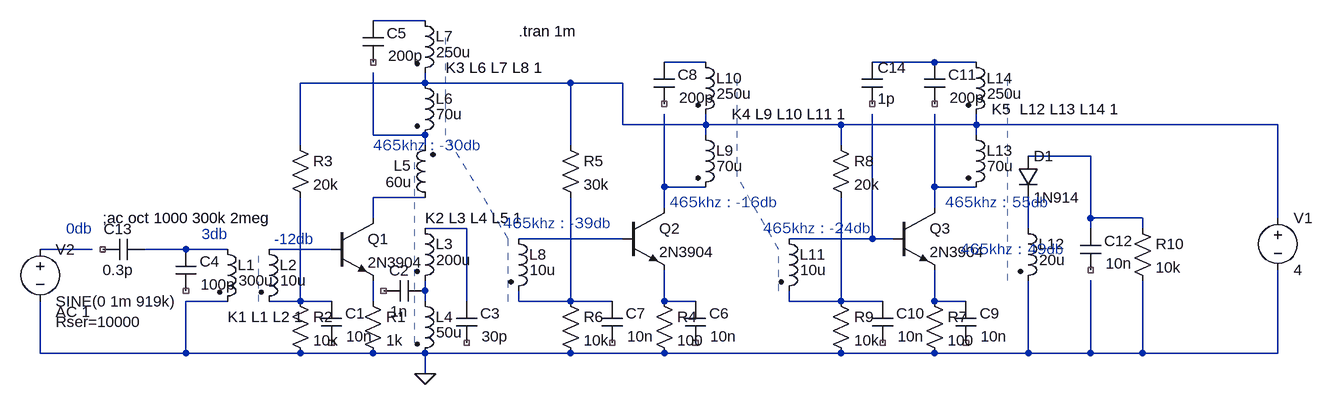
[diagram p0: schematic Draft3.asc]
Draft3.asc, the LTspice schematic file:
Version 4
SHEET 1 1692 680
WIRE 336 -288 256 -288
WIRE 768 -224 704 -224
WIRE 1120 -224 1024 -224
WIRE 1184 -224 1120 -224
WIRE 336 -192 336 -208
WIRE 336 -192 144 -192
WIRE 560 -192 336 -192
WIRE 640 -192 560 -192
WIRE 640 -128 640 -192
WIRE 768 -128 768 -144
WIRE 768 -128 640 -128
WIRE 976 -128 768 -128
WIRE 1184 -128 1184 -144
WIRE 1184 -128 976 -128
WIRE 1648 -128 1184 -128
WIRE 256 -112 256 -208
WIRE 336 -112 256 -112
WIRE 768 -112 768 -128
WIRE 1184 -112 1184 -128
WIRE 144 -96 144 -192
WIRE 336 -96 336 -112
WIRE 560 -96 560 -192
WIRE 976 -96 976 -128
WIRE 1360 -80 1264 -80
WIRE 704 -32 704 -144
WIRE 768 -32 704 -32
WIRE 1120 -32 1120 -144
WIRE 1184 -32 1120 -32
WIRE 336 -16 256 -16
WIRE 704 0 704 -32
WIRE 1120 0 1120 -32
WIRE 256 16 256 -16
WIRE 1360 16 1360 -80
WIRE 1440 16 1360 16
WIRE 1648 16 1648 -128
WIRE 400 32 336 32
WIRE 1264 32 1264 -16
WIRE 1360 32 1360 16
WIRE 1440 32 1440 16
WIRE 640 48 480 48
WIRE 1024 48 1024 -144
WIRE 1024 48 896 48
WIRE 1056 48 1024 48
WIRE -176 64 -256 64
WIRE -32 64 -96 64
WIRE 32 64 -32 64
WIRE 192 64 96 64
WIRE 256 128 256 112
WIRE 336 128 336 112
WIRE 32 144 -32 144
WIRE 144 144 144 -16
WIRE 144 144 96 144
WIRE 192 144 144 144
WIRE 256 144 256 128
WIRE 336 144 336 128
WIRE 400 144 400 32
WIRE 480 144 480 128
WIRE 560 144 560 -16
WIRE 560 144 480 144
WIRE 624 144 560 144
WIRE 704 144 704 96
WIRE 752 144 704 144
WIRE 896 144 896 128
WIRE 976 144 976 -16
WIRE 976 144 896 144
WIRE 1040 144 976 144
WIRE 1120 144 1120 96
WIRE 1168 144 1120 144
WIRE -256 224 -256 144
WIRE -32 224 -32 144
WIRE -32 224 -256 224
WIRE 144 224 -32 224
WIRE 192 224 144 224
WIRE 256 224 192 224
WIRE 336 224 256 224
WIRE 400 224 336 224
WIRE 560 224 400 224
WIRE 624 224 560 224
WIRE 704 224 624 224
WIRE 752 224 704 224
WIRE 976 224 752 224
WIRE 1040 224 976 224
WIRE 1120 224 1040 224
WIRE 1168 224 1120 224
WIRE 1264 224 1264 112
WIRE 1264 224 1168 224
WIRE 1360 224 1360 112
WIRE 1360 224 1264 224
WIRE 1440 224 1440 112
WIRE 1440 224 1360 224
WIRE 1648 224 1648 96
WIRE 1648 224 1440 224
WIRE 336 256 336 224
FLAG 336 256 0
SYMBOL npn 192 16 R0
SYMATTR InstName Q1
SYMATTR Value 2N3904
SYMBOL ind2 16 48 R0
WINDOW 0 32 40 Left 2
WINDOW 3 33 64 Left 2
SYMATTR InstName L1
SYMATTR Value 300u
SYMATTR Type ind
SYMBOL ind2 80 48 R0
WINDOW 0 32 40 Left 2
WINDOW 3 33 64 Left 2
SYMATTR InstName L2
SYMATTR Value 10u
SYMATTR Type ind
SYMBOL ind2 320 16 R0
WINDOW 0 32 40 Left 2
WINDOW 3 33 64 Left 2
SYMATTR InstName L3
SYMATTR Value 200u
SYMATTR Type ind
SYMBOL ind2 320 128 R0
WINDOW 0 32 40 Left 2
WINDOW 3 33 64 Left 2
SYMATTR InstName L4
SYMATTR Value 50u
SYMATTR Type ind
SYMBOL ind2 352 0 R180
WINDOW 0 37 65 Left 2
WINDOW 3 36 40 Left 2
SYMATTR InstName L5
SYMATTR Value 60u
SYMATTR Type ind
SYMBOL ind2 320 -208 R0
WINDOW 0 32 40 Left 2
WINDOW 3 33 64 Left 2
SYMATTR InstName L6
SYMATTR Value 70u
SYMATTR Type ind
SYMBOL ind2 320 -304 R0
WINDOW 0 32 40 Left 2
WINDOW 3 33 64 Left 2
SYMATTR InstName L7
SYMATTR Value 250u
SYMATTR Type ind
SYMBOL res 240 128 R0
SYMATTR InstName R1
SYMATTR Value 1k
SYMBOL res 128 128 R0
SYMATTR InstName R2
SYMATTR Value 10k
SYMBOL res 128 -112 R0
SYMATTR InstName R3
SYMATTR Value 20k
SYMBOL cap 176 144 R0
WINDOW 0 37 19 Left 2
WINDOW 3 39 54 Left 2
SYMATTR InstName C1
SYMATTR Value 10n
SYMBOL cap 336 112 R90
WINDOW 0 0 40 VBottom 2
WINDOW 3 32 40 VTop 2
SYMATTR InstName C2
SYMATTR Value 1n
SYMBOL cap 384 144 R0
WINDOW 0 37 19 Left 2
WINDOW 3 39 54 Left 2
SYMATTR InstName C3
SYMATTR Value 30p
SYMBOL cap -48 64 R0
WINDOW 0 37 19 Left 2
WINDOW 3 39 54 Left 2
SYMATTR InstName C4
SYMATTR Value 100p
SYMBOL cap 240 -288 R0
WINDOW 0 37 19 Left 2
WINDOW 3 39 54 Left 2
SYMATTR InstName C5
SYMATTR Value 200p
SYMBOL ind2 464 32 R0
WINDOW 0 32 40 Left 2
WINDOW 3 33 64 Left 2
SYMATTR InstName L8
SYMATTR Value 10u
SYMATTR Type ind
SYMBOL npn 640 0 R0
SYMATTR InstName Q2
SYMATTR Value 2N3904
SYMBOL res 688 128 R0
SYMATTR InstName R4
SYMATTR Value 100
SYMBOL cap 736 144 R0
WINDOW 0 37 19 Left 2
WINDOW 3 39 54 Left 2
SYMATTR InstName C6
SYMATTR Value 10n
SYMBOL res 544 -112 R0
SYMATTR InstName R5
SYMATTR Value 30k
SYMBOL res 544 128 R0
SYMATTR InstName R6
SYMATTR Value 10k
SYMBOL cap 608 144 R0
WINDOW 0 37 19 Left 2
WINDOW 3 39 54 Left 2
SYMATTR InstName C7
SYMATTR Value 10n
SYMBOL ind2 752 -128 R0
WINDOW 0 32 40 Left 2
WINDOW 3 33 64 Left 2
SYMATTR InstName L9
SYMATTR Value 70u
SYMATTR Type ind
SYMBOL ind2 752 -240 R0
WINDOW 0 32 40 Left 2
WINDOW 3 33 64 Left 2
SYMATTR InstName L10
SYMATTR Value 250u
SYMATTR Type ind
SYMBOL ind2 880 32 R0
WINDOW 0 32 40 Left 2
WINDOW 3 33 64 Left 2
SYMATTR InstName L11
SYMATTR Value 10u
SYMATTR Type ind
SYMBOL cap 688 -224 R0
WINDOW 0 37 19 Left 2
WINDOW 3 39 54 Left 2
SYMATTR InstName C8
SYMATTR Value 200p
SYMBOL ind2 1248 16 R0
WINDOW 0 32 40 Left 2
WINDOW 3 33 64 Left 2
SYMATTR InstName L12
SYMATTR Value 20u
SYMATTR Type ind
SYMBOL npn 1056 0 R0
SYMATTR InstName Q3
SYMATTR Value 2N3904
SYMBOL res 1104 128 R0
SYMATTR InstName R7
SYMATTR Value 100
SYMBOL cap 1152 144 R0
WINDOW 0 37 19 Left 2
WINDOW 3 39 54 Left 2
SYMATTR InstName C9
SYMATTR Value 10n
SYMBOL res 960 -112 R0
SYMATTR InstName R8
SYMATTR Value 20k
SYMBOL res 960 128 R0
SYMATTR InstName R9
SYMATTR Value 10k
SYMBOL cap 1024 144 R0
WINDOW 0 37 19 Left 2
WINDOW 3 39 54 Left 2
SYMATTR InstName C10
SYMATTR Value 10n
SYMBOL ind2 1168 -128 R0
WINDOW 0 32 40 Left 2
WINDOW 3 33 64 Left 2
SYMATTR InstName L13
SYMATTR Value 70u
SYMATTR Type ind
SYMBOL ind2 1168 -240 R0
WINDOW 0 32 40 Left 2
WINDOW 3 33 64 Left 2
SYMATTR InstName L14
SYMATTR Value 250u
SYMATTR Type ind
SYMBOL cap 1104 -224 R0
WINDOW 0 37 19 Left 2
WINDOW 3 39 54 Left 2
SYMATTR InstName C11
SYMATTR Value 200p
SYMBOL diode 1248 -80 R0
SYMATTR InstName D1
SYMATTR Value 1N914
SYMBOL cap 1344 32 R0
WINDOW 0 37 19 Left 2
WINDOW 3 39 54 Left 2
SYMATTR InstName C12
SYMATTR Value 10n
SYMBOL res 1424 16 R0
SYMATTR InstName R10
SYMATTR Value 10k
SYMBOL voltage 1648 0 R0
WINDOW 123 0 0 Left 0
WINDOW 39 0 0 Left 0
SYMATTR InstName V1
SYMATTR Value 4
SYMBOL voltage -256 48 R0
WINDOW 123 24 112 Left 2
WINDOW 39 24 128 Left 2
SYMATTR Value2 AC 1
SYMATTR SpiceLine Rser=10000
SYMATTR InstName V2
SYMATTR Value SINE(0 1m 919k)
SYMBOL cap -96 48 R90
WINDOW 0 0 40 VBottom 2
WINDOW 3 32 40 VTop 2
SYMATTR InstName C13
SYMATTR Value 0.3p
SYMBOL cap 1008 -224 R0
SYMATTR InstName C14
SYMATTR Value 1p
TEXT 32 168 Left 2 !K1 L1 L2 1
TEXT 336 16 Left 2 !K2 L3 L4 L5 1
TEXT 368 -216 Left 2 !K3 L6 L7 L8 1
TEXT 808 -144 Left 2 !K4 L9 L10 L11 1
TEXT 1208 -152 Left 2 !K5  L12 L13 L14 1
TEXT 480 -272 Left 2 !.tran 1m
TEXT -160 16 Left 2 !;ac oct 1000 300k 2meg
TEXT -216 32 Left 2 ;0db
TEXT -8 40 Left 2 ;3db
TEXT 104 48 Left 2 ;-12db
TEXT 256 -96 Left 2 ;465khz：-30db
TEXT 456 24 Left 2 ;465khz：-39db
TEXT 712 -8 Left 2 ;465khz：-16db
TEXT 856 32 Left 2 ;465khz：-24db
TEXT 1136 -8 Left 2 ;465khz：55db
TEXT 1160 64 Left 2 ;465khz：49db
LINE Normal 368 -112 368 -272 2
LINE Normal 464 48 368 -112 2
LINE Normal 464 144 464 48 2
LINE Normal 320 208 320 -80 2
LINE Normal 80 144 80 64 2
LINE Normal 816 -48 816 -208 2
LINE Normal 880 64 816 -48 2
LINE Normal 880 128 880 64 2
LINE Normal 1232 112 1232 -208 2

The netlist it stands for:
* Draft3.asc
Q1 N009 N016 N017 0 2N3904
L1 N015 0 300u
L2 N016 N019 10u
L3 N010 N018 200u
L4 N018 0 50u
L5 N009 N005 60u
L6 N004 N005 70u
L7 N001 N004 250u
R1 N017 0 1k
R2 N019 0 10k
R3 N004 N019 20k
C1 N019 NC_01 10n
C2 N018 NC_02 1n
C3 N010 NC_03 30p
C4 N015 NC_04 100p
C5 N001 NC_05 200p
L8 N012 N020 10u
Q2 N007 N012 N021 0 2N3904
R4 N021 0 100
C6 N021 NC_06 10n
R5 N004 N020 30k
R6 N020 0 10k
C7 N020 NC_07 10n
L9 N004 N007 70u
L10 N002 N004 250u
L11 N013 N022 10u
C8 N002 NC_08 200p
L12 N011 0 20u
Q3 N008 N013 N023 0 2N3904
R7 N023 0 100
C9 N023 NC_09 10n
R8 N004 N022 20k
R9 N022 0 10k
C10 N022 NC_10 10n
L13 N004 N008 70u
L14 N003 N004 250u
C11 N003 NC_11 200p
D1 N006 N011 1N914
C12 N006 NC_12 10n
R10 N006 0 10k
V1 N004 0 4
V2 N014 0 SINE(0 1m 919k) AC 1 Rser=10000
C13 N015 NC_13 0.3p
C14 N003 NC_14 1p
.model D D
.lib standard.dio
.model NPN NPN
.model PNP PNP
.lib standard.bjt
K1 L1 L2 1
K2 L3 L4 L5 1
K3 L6 L7 L8 1
K4 L9 L10 L11 1
K5  L12 L13 L14 1
.tran 1m
;ac oct 1000 300k 2meg
* 0db
* 3db
* -12db
* 465khz：-30db
* 465khz：-39db
* 465khz：-16db
* 465khz：-24db
* 465khz：55db
* 465khz：49db
.backanno
.end